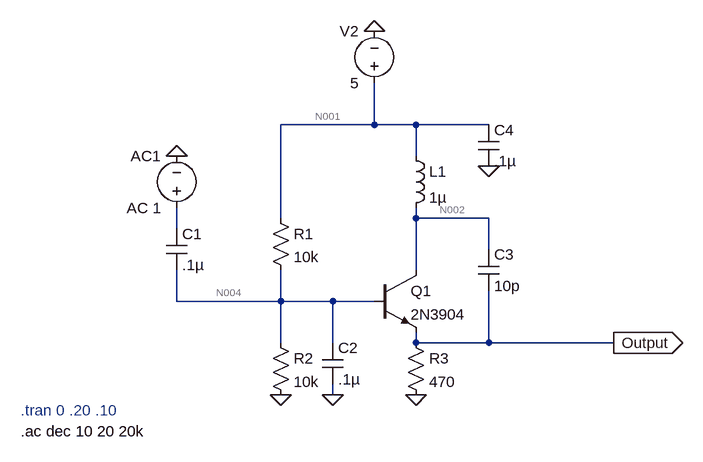
[diagram p0: schematic EE430_Project1.asc]
EE430_Project1.asc, the LTspice schematic file:
Version 4
SHEET 1 880 680
WIRE 160 -144 160 -208
WIRE 160 -144 16 -144
WIRE 224 -144 160 -144
WIRE 336 -144 224 -144
WIRE 224 -96 224 -144
WIRE 16 0 16 -144
WIRE 224 0 224 -16
WIRE 336 0 224 0
WIRE -144 16 -144 -16
WIRE 336 48 336 0
WIRE 224 80 224 0
WIRE -144 128 -144 80
WIRE 16 128 16 80
WIRE 16 128 -144 128
WIRE 96 128 16 128
WIRE 160 128 96 128
WIRE 16 192 16 128
WIRE 96 192 96 128
WIRE 224 192 224 176
WIRE 336 192 336 112
WIRE 336 192 224 192
WIRE 528 192 336 192
WIRE 96 272 96 256
FLAG -144 -96 0
FLAG 16 272 0
FLAG 96 272 0
FLAG 224 272 0
FLAG 336 -80 0
FLAG 528 192 Output
IOPIN 528 192 Out
FLAG 160 -288 0
SYMBOL npn 160 80 R0
SYMATTR InstName Q1
SYMATTR Value 2N3904
SYMBOL cap -160 16 R0
SYMATTR InstName C1
SYMATTR Value .1µ
SYMBOL voltage -144 0 R180
WINDOW 0 24 96 Left 2
WINDOW 3 24 16 Left 2
WINDOW 123 0 0 Left 0
WINDOW 39 0 0 Left 0
SYMATTR InstName AC1
SYMATTR Value AC 1
SYMBOL res 0 -16 R0
SYMATTR InstName R1
SYMATTR Value 10k
SYMBOL res 0 176 R0
SYMATTR InstName R2
SYMATTR Value 10k
SYMBOL cap 80 192 R0
SYMATTR InstName C2
SYMATTR Value .1µ
SYMBOL res 208 176 R0
SYMATTR InstName R3
SYMATTR Value 470
SYMBOL cap 320 48 R0
SYMATTR InstName C3
SYMATTR Value 10p
SYMBOL ind 208 -112 R0
SYMATTR InstName L1
SYMATTR Value 1µ
SYMBOL cap 320 -144 R0
SYMATTR InstName C4
SYMATTR Value .1µ
SYMBOL voltage 160 -192 R180
WINDOW 0 24 96 Left 2
WINDOW 3 24 16 Left 2
WINDOW 123 0 0 Left 0
WINDOW 39 0 0 Left 0
SYMATTR InstName V2
SYMATTR Value 5
TEXT -384 296 Left 2 ;.tran 0 .20 .10
TEXT -384 328 Left 2 !.ac dec 10 20 20k

The netlist it stands for:
* EE430_Project1.asc
Q1 N002 N004 Output 0 2N3904
C1 N003 N004 .1µ
V§AC1 N003 0 AC 1
R1 N001 N004 10k
R2 N004 0 10k
C2 N004 0 .1µ
R3 Output 0 470
C3 N002 Output 10p
L1 N001 N002 1µ
C4 N001 0 .1µ
V2 N001 0 5
.model NPN NPN
.model PNP PNP
.lib standard.bjt
* .tran 0 .20 .10
.ac dec 10 20 20k
.backanno
.end

* Results of the author's LTspice run, read from the files saved beside the schematic
* Operating Point, zero values left out:
*   V(n002) = 5 V
*   V(n004) = 2.439 V
*   V(output) = 1.75 V
*   V(n001) = 5 V
*   Ic(Q1) = 3.711 mA
*   Ib(Q1) = 12.17 µA
*   Ie(Q1) = -3.723 mA
*   I(L1) = 3.711 mA
*   I(R1) = 256.1 µA
*   I(R2) = 243.9 µA
*   I(R3) = 3.723 mA
*   I(V2) = -3.967 mA
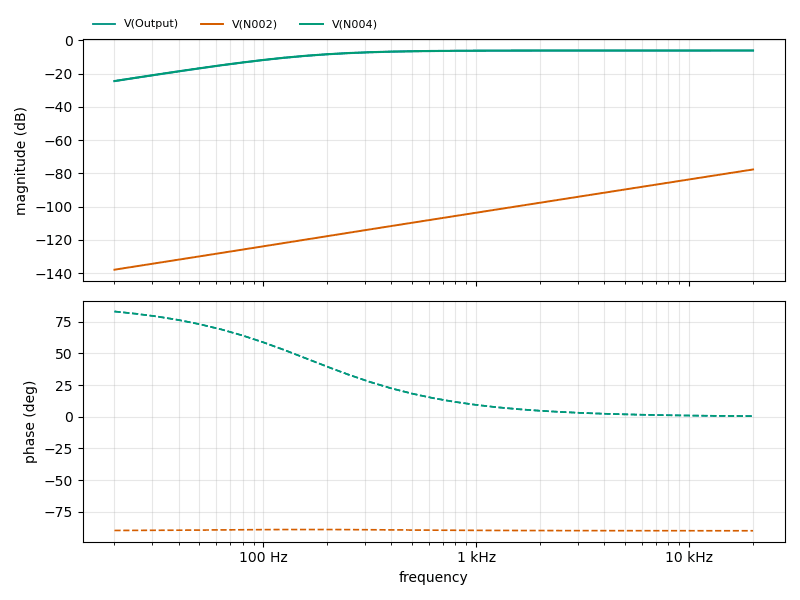
[diagram p1: AC Analysis of EE430_Project1.asc, plotted from the saved traces]
* AC Analysis, 1 run:
*   V(Output): -24.53 dB at 20 Hz, -6.15 dB at 20 kHz, peak -6.15 dB at 20 kHz, 3 dB below the peak at 165.4 Hz
*   V(N002): -137.94 dB at 20 Hz, -77.64 dB at 20 kHz, peak -77.64 dB at 20 kHz, 3 dB below the peak at 14.14 kHz
*   V(N004): -24.40 dB at 20 Hz, -6.02 dB at 20 kHz, peak -6.02 dB at 20 kHz, 3 dB below the peak at 165.4 Hz